# EAGLE design PET Hat Schematic (EAGLE 9.5.2)
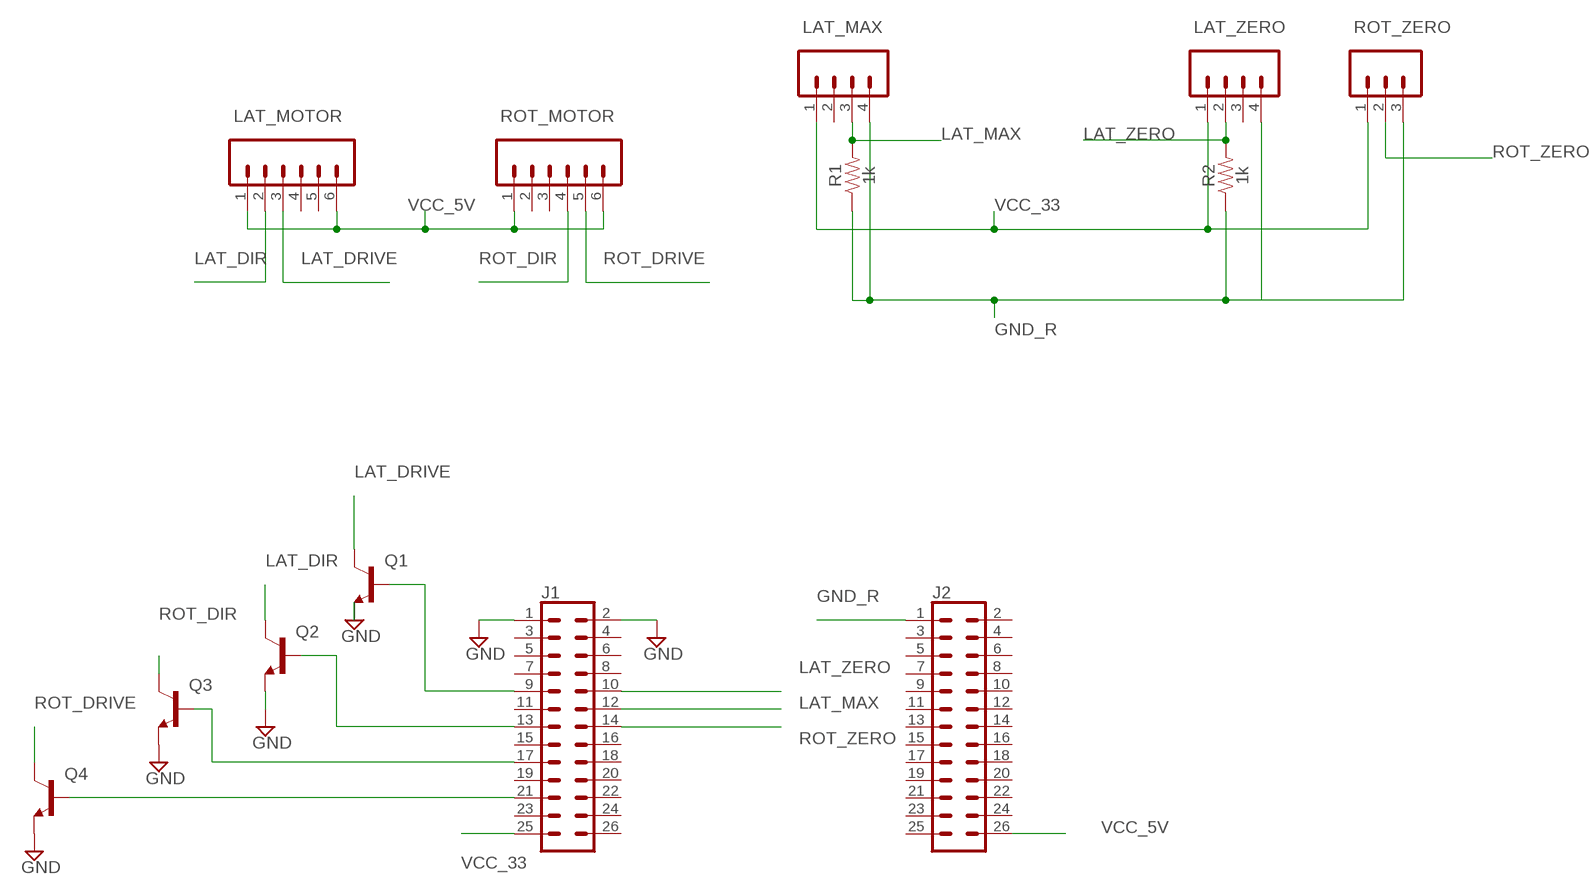
[diagram p0: schematic, sheet 1]

## Parts
J1  CONN_13X22X13  [2X13]
J2  CONN_13X22X13  [2X13]
LAT_MAX  CONN_04POLAR  [MOLEX-1X4]
LAT_MOTOR  CONN_06POLAR  [MOLEX-1X6]
LAT_ZERO  CONN_04POLAR  [MOLEX-1X4]
Q1  2N3904  [TO92]
Q2  2N3904  [TO92]
Q3  2N3904  [TO92]
Q4  2N3904  [TO92]
R1  1k  1KOHM-HORIZ-1/4W-5%  [AXIAL-0.3]
R2  1k  1KOHM-HORIZ-1/4W-5%  [AXIAL-0.3]
ROT_MOTOR  CONN_06POLAR  [MOLEX-1X6]
ROT_ZERO  CONN_03POLAR  [MOLEX-1X3]

## Nets
GND: J1.1 J1.2 Q1.3(E) Q2.3(E) Q3.3(E) Q4.3(E)
GND_R: J2.1 LAT_MAX.4 R1.P$1 R2.P$1 ROT_ZERO.3
GND_RIGHT: LAT_ZERO.4
LAT_DIR: LAT_MOTOR.2 Q2.1(C)
LAT_DRIVE: LAT_MOTOR.3 Q1.1(C)
LAT_MAX: J1.12 LAT_MAX.3 R1.P$2
LAT_ZERO: J1.10 LAT_ZERO.2 R2.P$2
N$1: J1.9 Q1.2(B)
N$2: J1.13 Q2.2(B)
N$3: J1.17 Q3.2(B)
N$4: J1.21 Q4.2(B)
ROT_DIR: Q3.1(C) ROT_MOTOR.4
ROT_DRIVE: Q4.1(C) ROT_MOTOR.5
ROT_ZERO: J1.14 ROT_ZERO.2
VCC_5V: J2.26 LAT_MOTOR.1 LAT_MOTOR.6 ROT_MOTOR.1 ROT_MOTOR.6
VCC_33: J1.25 LAT_MAX.1 LAT_ZERO.1 ROT_ZERO.1
Unconnected: J1.3 J1.4 J1.5 J1.6 J1.7 J1.8 J1.11 J1.15 J1.16 J1.18 J1.19 J1.20 J1.22 J1.23 J1.24 J1.26 J2.2 J2.3 J2.4 J2.5 J2.6 J2.7 J2.8 J2.9 J2.10 J2.11 J2.12 J2.13 J2.14 J2.15 J2.16 J2.17 J2.18 J2.19 J2.20 J2.21 J2.22 J2.23 J2.24 J2.25 LAT_MAX.2 LAT_MOTOR.4 LAT_MOTOR.5 LAT_ZERO.3 ROT_MOTOR.2 ROT_MOTOR.3

## Library data of the parts
J1 J2 = SparkFun-Connectors:CONN_13X2: Multi connection point. Often used as Generic Header-pin footprint for 0.1 inch spaced/style header connections On any of the 0.1 inch spaced packages, you can populate with these: Break Away Headers - Straight <https://www.sparkfun.com/products/116> (PRT-00116) Break Away Male Headers - Right Angle <https://www.sparkfun.com/products/553> (PRT-00553) Female Headers <https://www.sparkfun.com/products/115> (PRT-00115) Break Away Headers - Machine Pin <https://www.sparkfun.com/products/117> (PRT-00117) Break Away Female Headers - Swiss Machine Pin <https://www.sparkfun.com/products/743> (PRT-00743)
LAT_MAX LAT_ZERO = SparkFun-Connectors:CONN_04: Multi connection point. Often used as Generic Header-pin footprint for 0.1 inch spaced/style header connections On any of the 0.1 inch spaced packages, you can populate with these: Break Away Headers - Straight <https://www.sparkfun.com/products/116> (PRT-00116) Break Away Male Headers - Right Angle <https://www.sparkfun.com/products/553> (PRT-00553) Female Headers <https://www.sparkfun.com/products/115> (PRT-00115) Break Away Headers - Machine Pin <https://www.sparkfun.com/products/117> (PRT-00117) Break Away Female Headers - Swiss Machine Pin <https://www.sparkfun.com/products/743> (PRT-00743) For SCREWTERMINALS and SPRING TERMINALS visit here: Screw Terimnals on SparkFun.com <https://www.sparkfun.com/search/results?term=Screw+Terminals> (5mm/3.5mm/2.54mm spacing) This device is also useful as a general connection point to wire up your design to another part of your project. Our various solder wires solder well into these plated through hole pads. Hook-Up Wire - Assortment (Stranded, 22 AWG) <https://www.sparkfun.com/products/11375> (PRT-11375) Hook-Up Wire - Assortment (Solid Core, 22 AWG) <https://www.sparkfun.com/products/11367> (PRT-11367) View the entire wire category on our website here <https://www.sparkfun.com/categories/141> Special notes: Molex polarized connector foot print use with SKU : PRT-08231 with associated crimp pins and housings. 1MM SMD Version SKU: PRT-10208; PROD_ID: CONN-08186; SF_ID: PRT-08231
LAT_MOTOR ROT_MOTOR = SparkFun-Connectors:CONN_06: Multi connection point. Often used as Generic Header-pin footprint for 0.1 inch spaced/style header connections On any of the 0.1 inch spaced packages, you can populate with these: Break Away Headers - Straight <https://www.sparkfun.com/products/116> (PRT-00116) Break Away Male Headers - Right Angle <https://www.sparkfun.com/products/553> (PRT-00553) Female Headers <https://www.sparkfun.com/products/115> (PRT-00115) Break Away Headers - Machine Pin <https://www.sparkfun.com/products/117> (PRT-00117) Break Away Female Headers - Swiss Machine Pin <https://www.sparkfun.com/products/743> (PRT-00743) Arduino Stackable Header - 6 Pin <https://www.sparkfun.com/products/9280> (PRT-09280) For SCREWTERMINALS and SPRING TERMINALS visit here: Screw Terimnals on SparkFun.com <https://www.sparkfun.com/search/results?term=Screw+Terminals> (5mm/3.5mm/2.54mm spacing) This device is also useful as a general connection point to wire up your design to another part of your project. Our various solder wires solder well into these plated through hole pads. Hook-Up Wire - Assortment (Stranded, 22 AWG) <https://www.sparkfun.com/products/11375> (PRT-11375) Hook-Up Wire - Assortment (Solid Core, 22 AWG) <https://www.sparkfun.com/products/11367> (PRT-11367) View the entire wire category on our website here <https://www.sparkfun.com/categories/141>
Q1-Q4 = transistor-npn:2N3904: NPN Transistor
R1 R2 = SparkFun-Resistors:1KOHM: 1kΩ resistor A resistor is a passive two-terminal electrical component that implements electrical resistance as a circuit element. Resistors act to reduce current flow, and, at the same time, act to lower voltage levels within circuits. - Wikipedia; PROD_ID: RES-08380
ROT_ZERO = SparkFun-Connectors:CONN_03: Multi connection point. Often used as Generic Header-pin footprint for 0.1 inch spaced/style header connections On any of the 0.1 inch spaced packages, you can populate with these: Break Away Headers - Straight <https://www.sparkfun.com/products/116> (PRT-00116) Break Away Male Headers - Right Angle <https://www.sparkfun.com/products/553> (PRT-00553) Female Headers <https://www.sparkfun.com/products/115> (PRT-00115) Break Away Headers - Machine Pin <https://www.sparkfun.com/products/117> (PRT-00117) Break Away Female Headers - Swiss Machine Pin <https://www.sparkfun.com/products/743> (PRT-00743) Stackable Header - 3 Pin (Female, 0.1") <https://www.sparkfun.com/products/13875> (PRT-13875) For SCREWTERMINALS and SPRING TERMINALS visit here: Screw Terimnals on SparkFun.com <https://www.sparkfun.com/search/results?term=Screw+Terminals> (5mm/3.5mm/2.54mm spacing) This device is also useful as a general connection point to wire up your design to another part of your project. Our various solder wires solder well into these plated through hole pads. Hook-Up Wire - Assortment (Stranded, 22 AWG) <https://www.sparkfun.com/products/11375> (PRT-11375) Hook-Up Wire - Assortment (Solid Core, 22 AWG) <https://www.sparkfun.com/products/11367> (PRT-11367) View the entire wire category on our website here <https://www.sparkfun.com/categories/141> Special notes: Molex polarized connector foot print use with SKU : PRT-08232 with associated crimp pins and housings.; PROD_ID: CONN-08625; SF_ID: PRT-08096

## Board
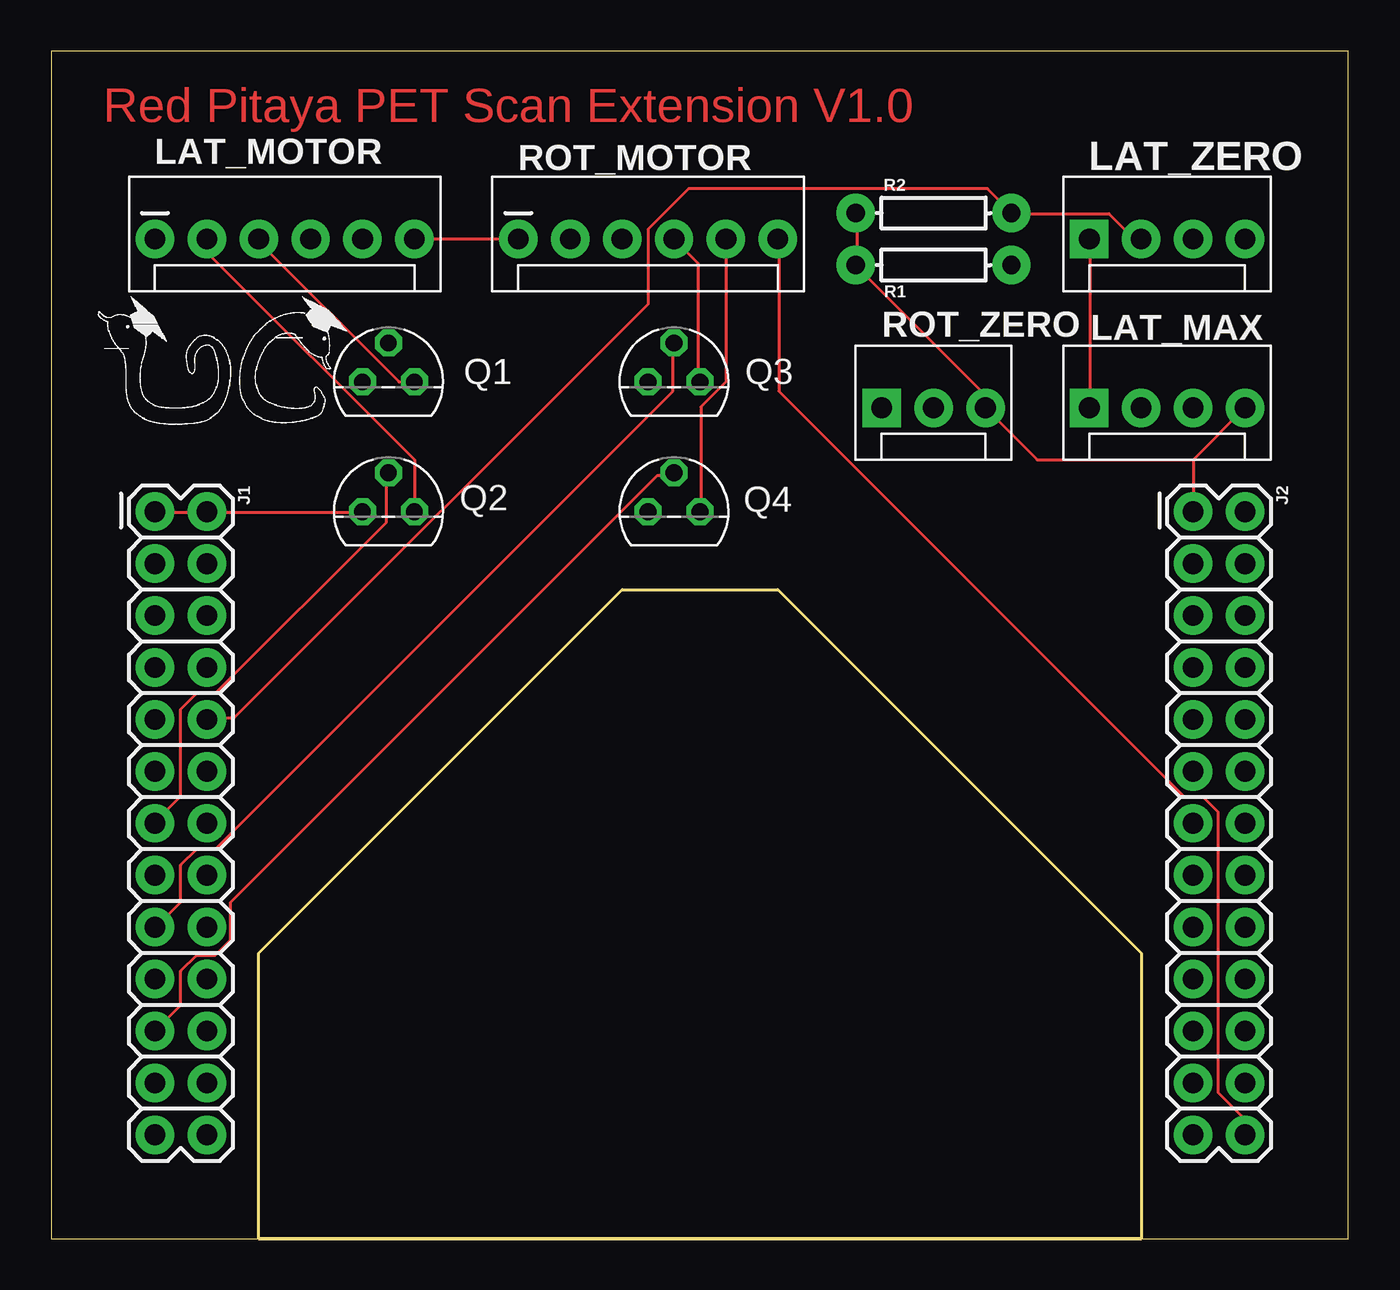
[diagram p1: board, top side]
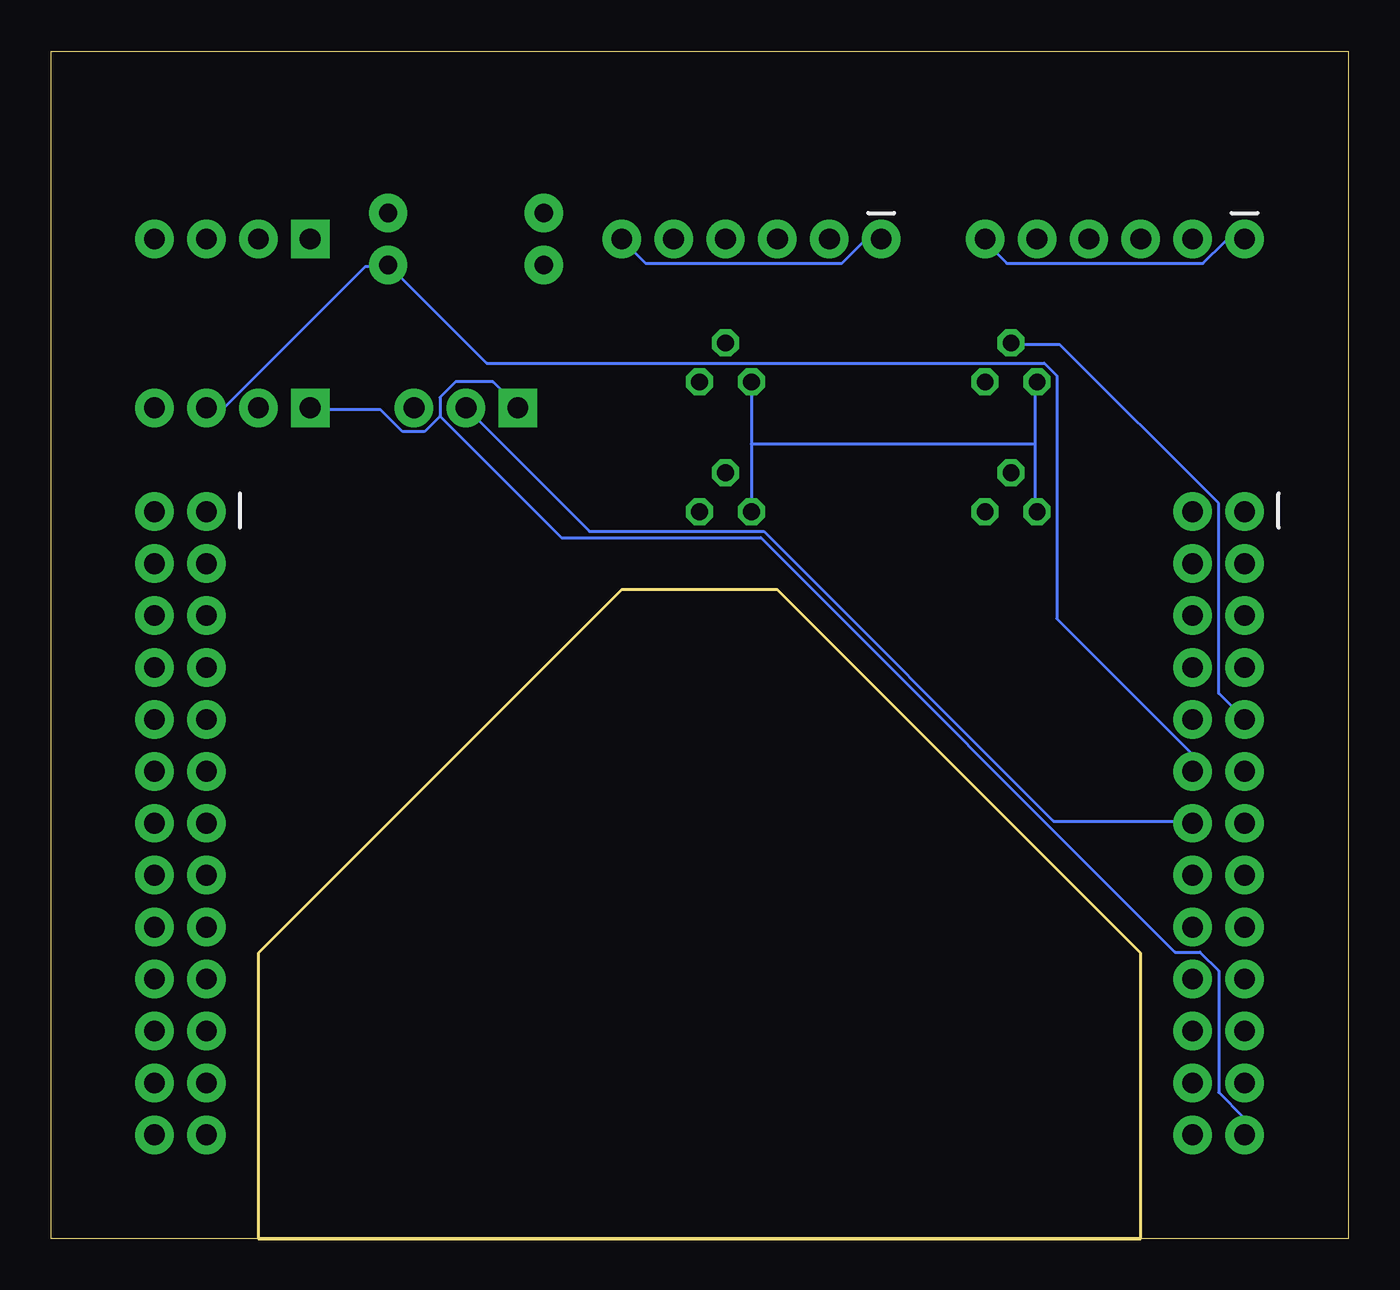
[diagram p2: board, bottom side, seen from below]

Size 63.48 x 58.09 mm. Coordinates in mm from the lower left corner, seen from the top.
Outline: 0,0 63.48,0 63.48,58.09 0,58.09 0,0
Copper layers (1*16): Top 0.035mm / dielectric 1.5mm / Bottom 0.035mm
Design rules "default": minimum track width 6mil, minimum drill 0.35mm, track to track 6mil, track to pad 6mil, pad to pad 6mil, via to via 6mil, smd to smd 6mil, copper to edge 40mil, drill to drill 6mil, minimum pad ring 10mil, minimum via ring 8mil, stop-mask expansion 4mil, vias tented up to drill 0mil, thermal gap 10mil
Milling: 6 lines

### Footprints (pad centres in the part's own frame; a part is rotated, then mirrored left to right if it is on the bottom)
2X13 = drill 1.016 pad 1.88: 1 0,0; 2 0,2.54; 3 2.54,0; 4 2.54,2.54; 5 5.08,0; 6 5.08,2.54; 7 7.62,0; 8 7.62,2.54; 9 10.16,0; 10 10.16,2.54; 11 12.7,0; 12 12.7,2.54; 13 15.24,0; 14 15.24,2.54; 15 17.78,0; 16 17.78,2.54; 17 20.32,0; 18 20.32,2.54; 19 22.86,0; 20 22.86,2.54; 21 25.4,0; 22 25.4,2.54; 23 27.94,0; 24 27.94,2.54; 25 30.48,0; 26 30.48,2.54
MOLEX-1X4 = drill 1.016 pad 1.88 square: 1 0,0 | drill 1.016 pad 1.88: 2 2.54,0; 3 5.08,0; 4 7.62,0
MOLEX-1X6 = drill 1.016 pad 1.88: 1 0,0; 2 2.54,0; 3 5.08,0; 4 7.62,0; 5 10.16,0; 6 12.7,0
TO92 = drill 0.813 octagon: 1 1.27,0; 2 0,1.905; 3 -1.27,0
AXIAL-0.3 = drill 0.9 pad 1.88: P$1 -3.81,0; P$2 3.81,0
MOLEX-1X3 = drill 1.016 pad 1.88 square: 1 0,0 | drill 1.016 pad 1.88: 2 2.54,0; 3 5.08,0

### Placement (x,y rotation side)
J1  5.08,35.56 270 top
J2  55.88,35.56 270 top
LAT_MAX  50.8,40.64 0 top
LAT_MOTOR  5.08,48.89 0 top
LAT_ZERO  50.8,48.89 0 top
Q1  16.51,41.91 0 top
Q2  16.51,35.56 0 top
Q3  30.48,41.91 0 top
Q4  30.48,35.56 0 top
R1  43.18,47.62 0 top
R2  43.18,50.17 0 top
ROT_MOTOR  22.86,48.89 0 top
ROT_ZERO  40.64,40.64 0 top

### Tracks (layer width: path | path; a pad name or v marks a point on that pad's centre or on a via)
GND
  Top 0.152: J1.1 5.13,35.51 7.57,35.51 J1.2 7.72,35.51 15.19,35.51 Q2.3
  Bottom 0.152: Q3.3 29.21,38.86 | 29.21,38.86 Q4.3 | 15.34,38.86 15.34,41.91 Q1.3 | 15.34,38.86 15.34,35.66 Q2.3 | 15.34,38.86 29.21,38.86
GND_R
  Top 0.152: 55.88,38.1 J2.1 | LAT_MAX.4 55.88,38.1 | R2.P$1 39.42,50.14 39.42,47.7 R1.P$1 39.42,47.55 45.67,41.3 45.67,40.69 ROT_ZERO.3 48.26,38.1 55.88,38.1
LAT_DIR
  Top 0.152: Q2.1 17.78,38.1 7.72,48.16 7.72,48.77 LAT_MOTOR.2
LAT_DRIVE
  Top 0.152: Q1.1 17.02,41.91 10.16,48.77 LAT_MOTOR.3
LAT_MAX
  Bottom 0.152: J1.12 7.72,22.86 7.72,23.77 14.27,30.33 14.27,42.22 14.88,42.82 42.16,42.82 46.89,47.55 R1.P$2 47.04,47.55 48.11,47.55 54.97,40.69 55.88,40.69 LAT_MAX.3
LAT_ZERO
  Top 0.152: J1.10 7.72,25.45 8.94,25.45 29.21,45.72 29.21,49.38 31.19,51.36 45.82,51.36 46.89,50.29 R2.P$2 47.04,50.14 51.76,50.14 52.98,48.92 53.29,48.92 LAT_ZERO.2
N$1
  Bottom 0.152: J1.9 6.35,26.67 6.35,35.97 14.12,43.74 16.41,43.74 Q1.2
N$2
  Top 0.152: Q2.2 16.41,37.34 16.41,35.05 8.03,26.67 7.11,26.67 6.35,25.91 6.35,21.64 5.13,20.42 J1.13
N$3
  Top 0.152: Q3.2 30.43,43.74 30.43,41.45 8.03,19.05 7.11,19.05 6.35,18.29 6.35,16.46 5.13,15.24 J1.17
N$4
  Top 0.152: J1.21 6.35,11.43 6.35,13.11 7.11,13.87 8.03,13.87 8.79,14.63 8.79,16.46 29.67,37.34 30.43,37.34 Q4.2
ROT_DIR
  Top 0.152: Q3.1 31.65,41.91 31.65,47.7 30.58,48.77 ROT_MOTOR.4
ROT_DRIVE
  Top 0.152: ROT_MOTOR.5 33.02,41.91 31.8,40.69 31.8,35.66 Q4.1
ROT_ZERO
  Bottom 0.152: ROT_ZERO.2 37.13,34.59 28.6,34.59 14.43,20.42 7.72,20.42 J1.14
VCC_5V
  Top 0.152: ROT_MOTOR.1 22.81,48.92 17.78,48.92 LAT_MOTOR.6 | J2.26 58.32,5.18 58.32,5.94 57.1,7.16 57.1,20.88 56.34,21.64 55.42,21.64 35.61,41.45 35.61,48.77 ROT_MOTOR.6
  Bottom 0.152: LAT_MOTOR.1 5.13,48.77 6.04,48.77 7.11,47.7 16.71,47.7 17.78,48.77 LAT_MOTOR.6 | ROT_MOTOR.1 22.96,48.77 23.72,48.77 24.79,47.7 34.39,47.7 35.46,48.77 ROT_MOTOR.6
VCC_33
  Top 0.152: LAT_ZERO.1 50.85,48.77 50.85,40.69 LAT_MAX.1
  Bottom 0.152: 44.45,40.23 38.51,34.29 28.75,34.29 8.48,14.02 7.26,14.02 6.35,13.11 6.35,7.16 5.13,5.94 5.13,5.18 J1.25 | 44.45,40.23 44.45,41.15 43.69,41.91 41.86,41.91 40.64,40.69 ROT_ZERO.1 | 44.45,40.23 45.21,39.47 46.28,39.47 47.35,40.54 50.7,40.54 LAT_MAX.1

### Text on the board
Top: Red Pitaya PET Scan Extension V1.0